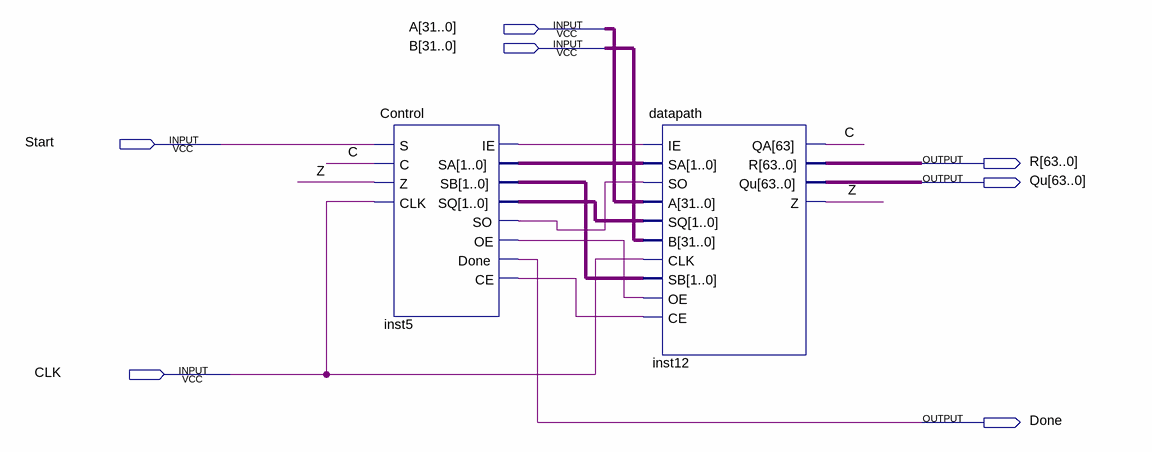
[diagram p0: schematic sheet]
// Quartus schematic division.bdf as structural Verilog: 2 symbols, 7 pins
module division (
  input  [31:0] A,
  input  [31:0] B,
  input  Start,
  input  CLK,
  output [63:0] R,
  output [63:0] Qu,
  output Done
);

  wire C, inst5_ce, inst5_ie, inst5_oe, inst5_so, Z;
  wire [1:0] inst5_sa, inst5_sb, inst5_sq;

  Control inst5 (
    .S(Start), .C(C), .Z(Z), .CLK(CLK), .IE(inst5_ie), .SA(inst5_sa), .SB(inst5_sb), .SQ(inst5_sq),
    .SO(inst5_so), .OE(inst5_oe), .Done(Done), .CE(inst5_ce));
  datapath inst12 (
    .IE(inst5_ie), .SA(inst5_sa), .SO(inst5_so), .A(A), .SQ(inst5_sq), .B(B), .CLK(CLK), .SB(inst5_sb),
    .OE(inst5_oe), .CE(inst5_ce), .QA(C), .R(R), .Qu(Qu), .Z(Z));
endmodule
